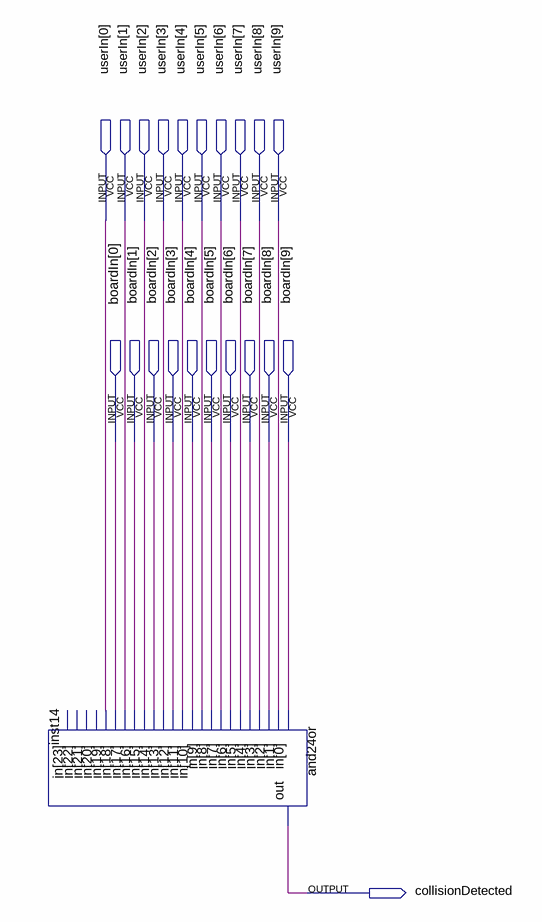
[diagram p0: schematic sheet]
// Quartus schematic Collisiondetection.bdf as structural Verilog: 1 symbols, 21 pins
module Collisiondetection (
  input  [9:0] userIn,
  input  [9:0] boardIn,
  output collisionDetected
);

  and24or inst14 (
    .in({4'bzzzz, userIn[0], boardIn[0], userIn[1], boardIn[1], userIn[2], boardIn[2], userIn[3], boardIn[3], userIn[4], boardIn[4], userIn[5], boardIn[5], userIn[6], boardIn[6], userIn[7], boardIn[7], userIn[8], boardIn[8], userIn[9], boardIn[9]}),
    .out(collisionDetected));
endmodule
